# Altium schematic sheet oscillator.SchDoc
size A4
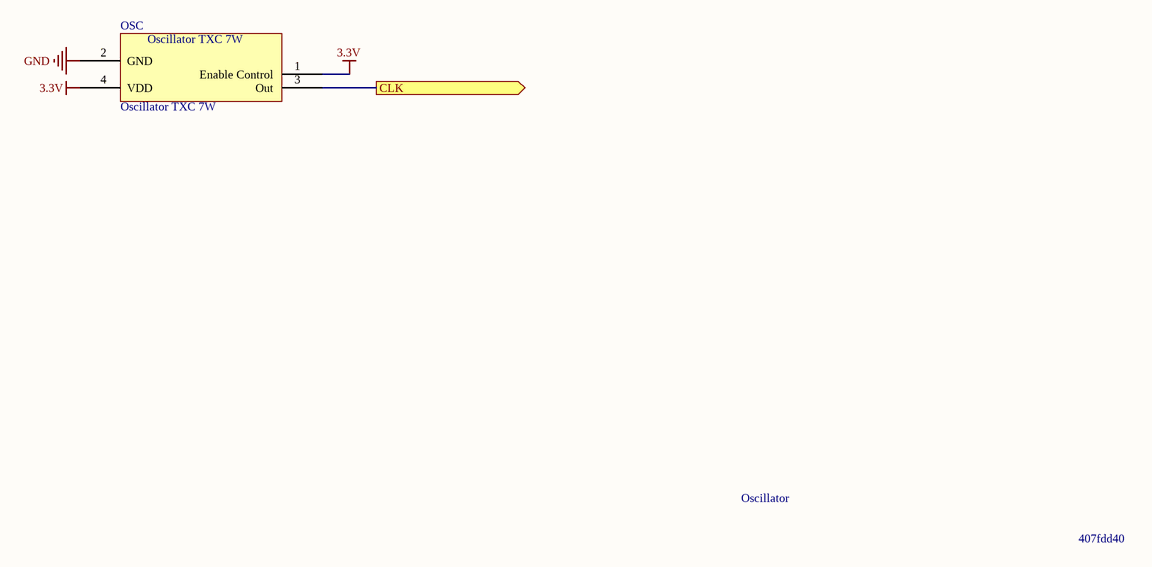
[diagram p0: oscillator.SchDoc]

## Parts
OSC  Oscillator TXC 7W  [TXC - 7W-60.000MBB-T]

## Ports
CLK (out)

## Nets
3.3V: OSC.1(Enable_Control) OSC.4(VDD)
GND: OSC.2(GND)
CLK: OSC.3(Out) ; port CLK

## Notes on the sheet
- Oscillator
- 407fdd40